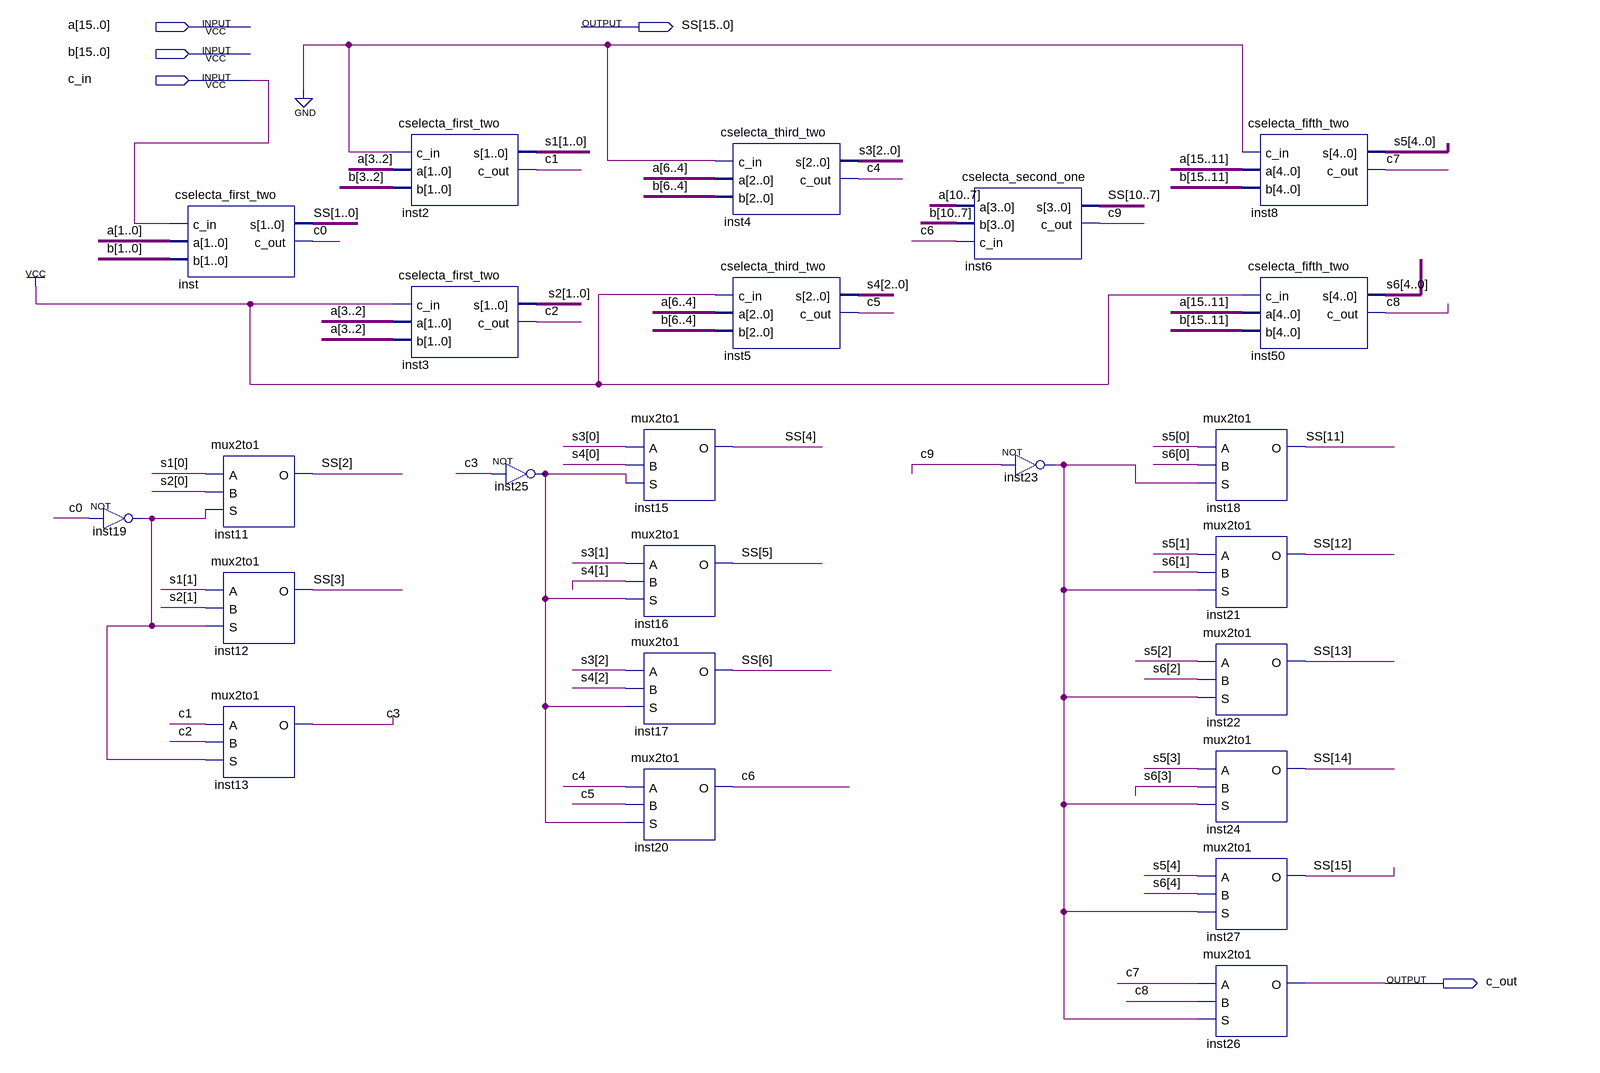
[diagram p0: schematic sheet]
// Quartus schematic Carry_Select_Adder_not_Uniform.bdf as structural Verilog: 24 symbols, 5 pins
module Carry_Select_Adder_not_Uniform (
  input  [15:0] a,
  input  [15:0] b,
  input  c_in,
  output [15:0] SS,
  output c_out
);

  wire c0, c1, c2, c3, c4, c5, c6, c7, c8, c9, inst19_out, inst23_out, inst25_out;
  wire [1:0] s1, s2;
  wire [2:0] s3, s4;
  wire [4:0] s5, s6;

  not inst19 (inst19_out, c0);
  cselecta_first_two inst (.c_in(c_in), .a(a[1:0]), .b(b[1:0]), .s(SS[1:0]), .c_out(c0));
  mux2to1 inst11 (.A(s1[0]), .B(s2[0]), .S(inst19_out), .O(SS[2]));
  mux2to1 inst12 (.A(s1[1]), .B(s2[1]), .S(inst19_out), .O(SS[3]));
  mux2to1 inst13 (.A(c1), .B(c2), .S(inst19_out), .O(c3));
  cselecta_first_two inst2 (.c_in(1'b0), .a(a[3:2]), .b(b[3:2]), .s(s1), .c_out(c1));
  cselecta_first_two inst3 (.c_in(1'b1), .a(a[3:2]), .b(a[3:2]), .s(s2), .c_out(c2));
  not inst25 (inst25_out, c3);
  mux2to1 inst15 (.A(s3[0]), .B(s4[0]), .S(inst25_out), .O(SS[4]));
  mux2to1 inst16 (.A(s3[1]), .B(s4[1]), .S(inst25_out), .O(SS[5]));
  mux2to1 inst17 (.A(s3[2]), .B(s4[2]), .S(inst25_out), .O(SS[6]));
  mux2to1 inst20 (.A(c4), .B(c5), .S(inst25_out), .O(c6));
  cselecta_third_two inst4 (.c_in(1'b0), .a(a[6:4]), .b(b[6:4]), .s(s3), .c_out(c4));
  cselecta_third_two inst5 (.c_in(1'b1), .a(a[6:4]), .b(b[6:4]), .s(s4), .c_out(c5));
  cselecta_second_one inst6 (.a(a[10:7]), .b(b[10:7]), .c_in(c6), .s(SS[10:7]), .c_out(c9));
  not inst23 (inst23_out, c9);
  mux2to1 inst18 (.A(s5[0]), .B(s6[0]), .S(inst23_out), .O(SS[11]));
  mux2to1 inst21 (.A(s5[1]), .B(s6[1]), .S(inst23_out), .O(SS[12]));
  mux2to1 inst22 (.A(s5[2]), .B(s6[2]), .S(inst23_out), .O(SS[13]));
  mux2to1 inst24 (.A(s5[3]), .B(s6[3]), .S(inst23_out), .O(SS[14]));
  mux2to1 inst27 (.A(s5[4]), .B(s6[4]), .S(inst23_out), .O(SS[15]));
  mux2to1 inst26 (.A(c7), .B(c8), .S(inst23_out), .O(c_out));
  cselecta_fifth_two inst8 (.c_in(1'b0), .a(a[15:11]), .b(b[15:11]), .s(s5), .c_out(c7));
  cselecta_fifth_two inst50 (.c_in(1'b1), .a(a[15:11]), .b(b[15:11]), .s(s6), .c_out(c8));
endmodule
